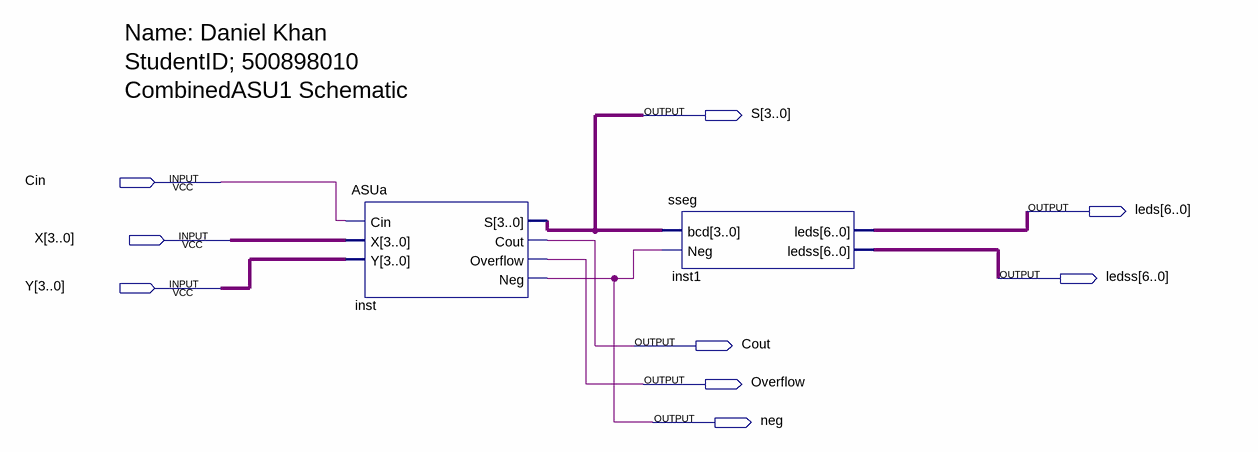
[diagram p0: schematic sheet]
// Quartus schematic CombinedASU1.bdf as structural Verilog: 2 symbols, 9 pins
module CombinedASU1 (
  input  Cin,
  input  [3:0] X,
  input  [3:0] Y,
  output [3:0] S,
  output [6:0] leds,
  output [6:0] ledss,
  output Cout,
  output Overflow,
  output neg
);

  ASUa inst (.Cin(Cin), .X(X), .Y(Y), .S(S), .Cout(Cout), .Overflow(Overflow), .Neg(neg));
  sseg inst1 (.bcd(S), .Neg(neg), .leds(leds), .ledss(ledss));

  // Notes on the sheet:
  //   Name: Daniel Khan
  //   StudentID; 500898010
  //   CombinedASU1 Schematic
endmodule
